# Altium schematic sheet LAUNCHXL-F28377S_0.SchDoc: LAUNCHXL-F28377S.sch
size 301 x 238 mm; Date: 6/30/2015 1:27:50 PM; DocumentNumber: Document Number:; Revision: REV:; SheetNumber: 1
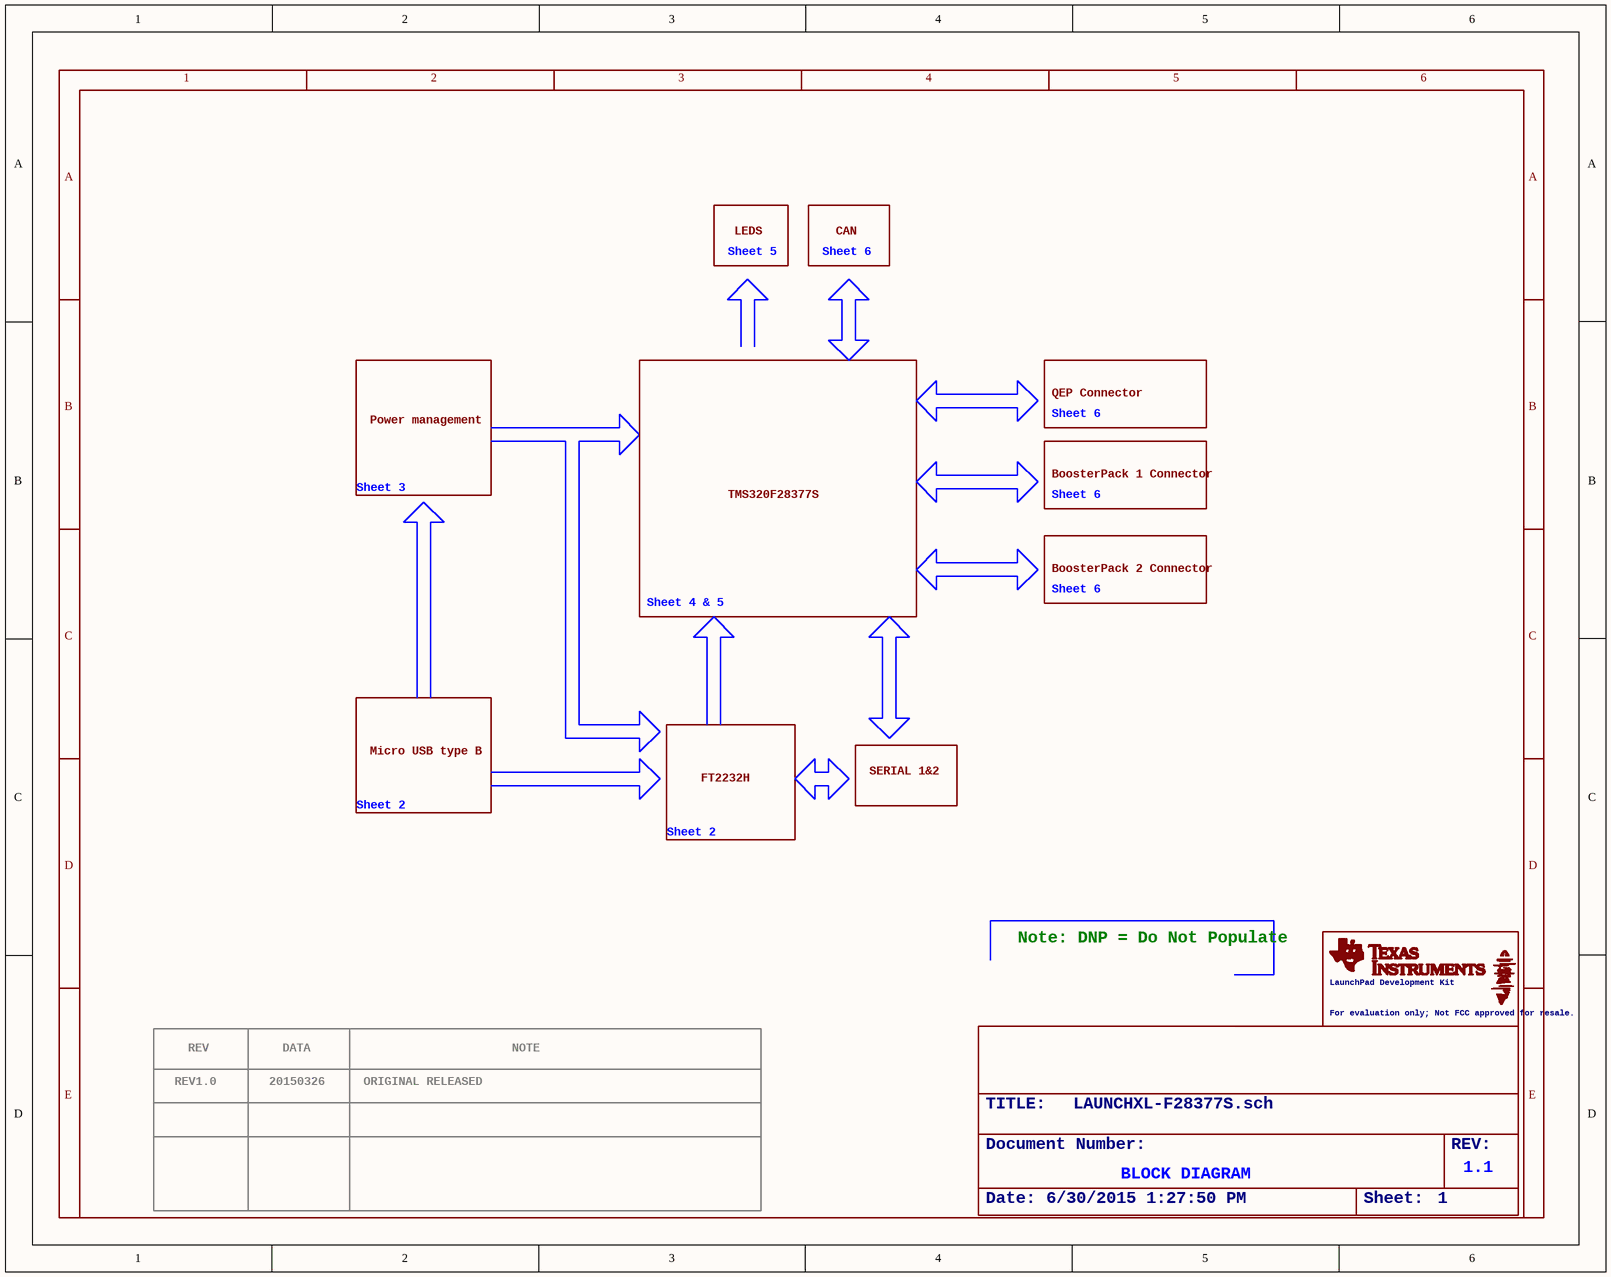
[diagram p0: LAUNCHXL-F28377S_0.SchDoc]

## Parts
COMPLIANCE1  COMPLIANCE_NOT_FCC_TESTEDBOARDS_LARGER_THAN_4IN  [COMPLIANCE_NOT_FCC]  (value not drawn)

## Notes on the sheet
- Sheet 5
- LEDS
- Sheet 6
- CAN
- QEP Connector
- Sheet 3
- Power management
- BoosterPack 1 Connector
- TMS320F28377S
- Sheet 4 & 5
- BoosterPack 2 Connector
- Micro USB type B
- Sheet 2
- FT2232H
- SERIAL 1&2
- Note: DNP = Do Not Populate
- REV1.0
- REV
- 20150326
- DATA
- ORIGINAL RELEASED
- NOTE
- BLOCK DIAGRAM
- 1.1
- 1
- 2
- 3
- 4
- 5
- 6
- A
- B
- C
- D
- E

## Library data of the parts
COMPLIANCE1 = COMPLIANCE_NOT_FCC_TESTEDBOARDS_LARGER_THAN_4IN: For evaluation only;